# EasyEDA Pro project ProPrj_ESP系列自动烧录平台_2024-12-23.epro, board ESP全系列烧录平台 copy
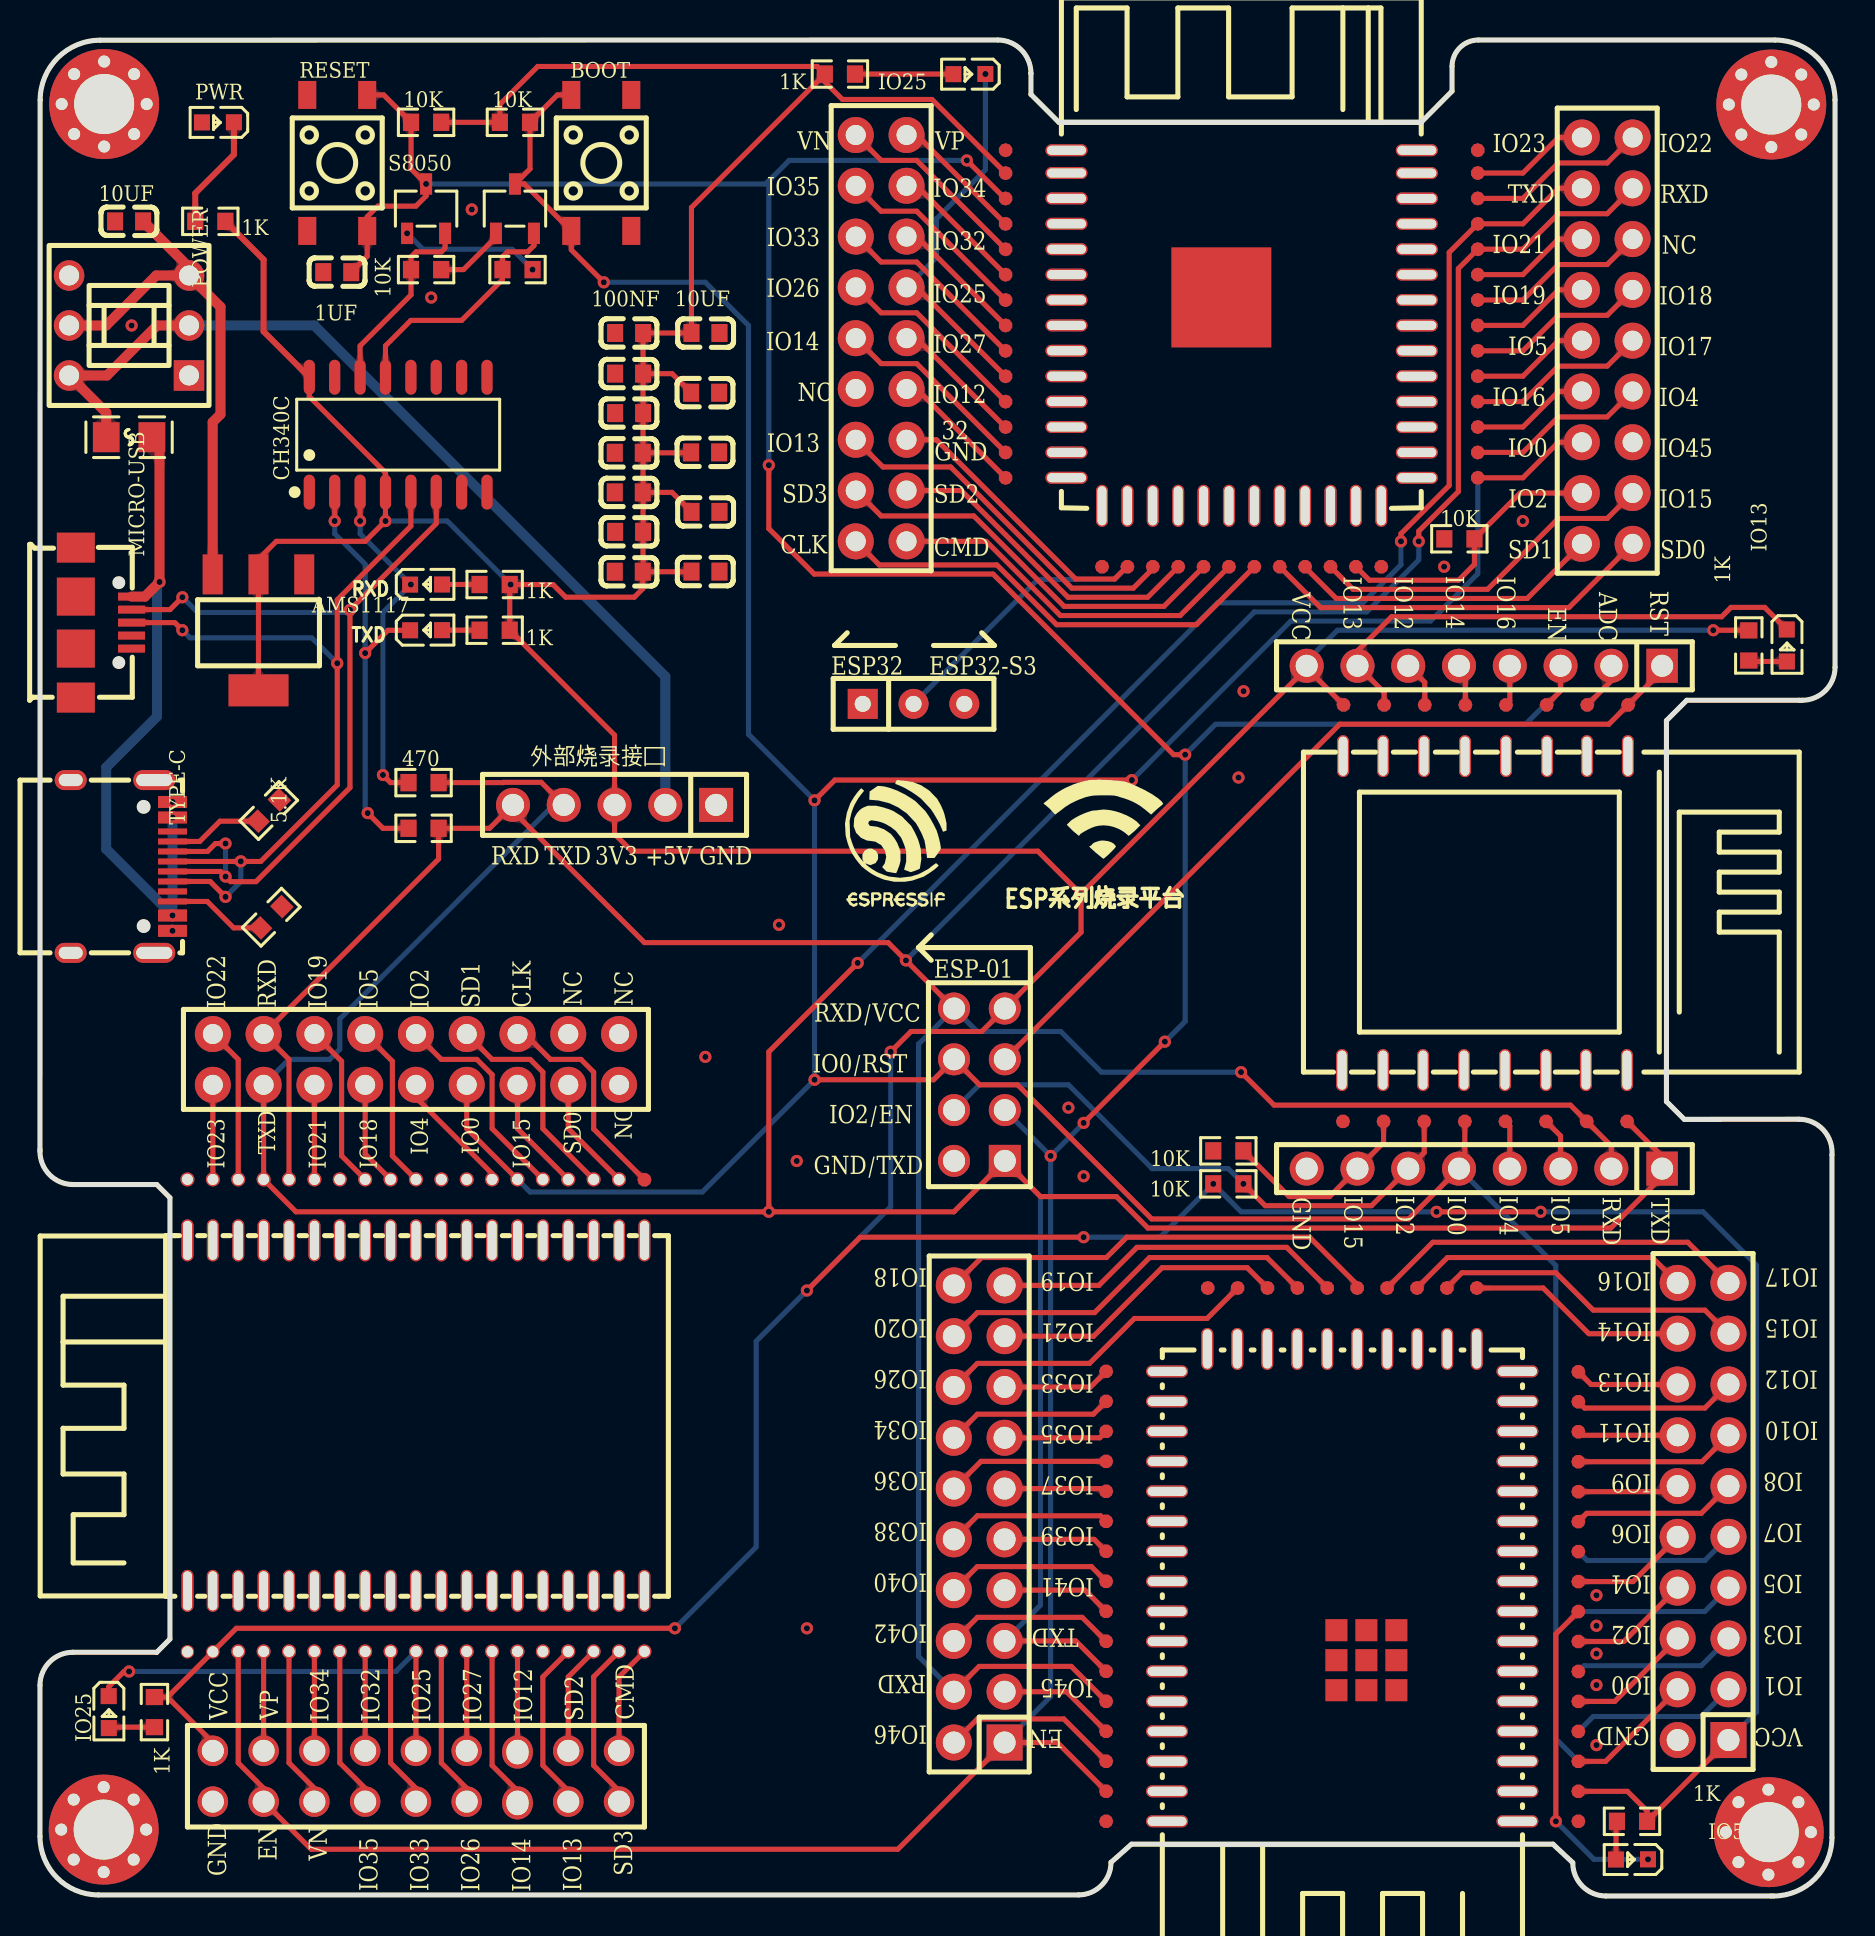
[diagram p1: board, top side]
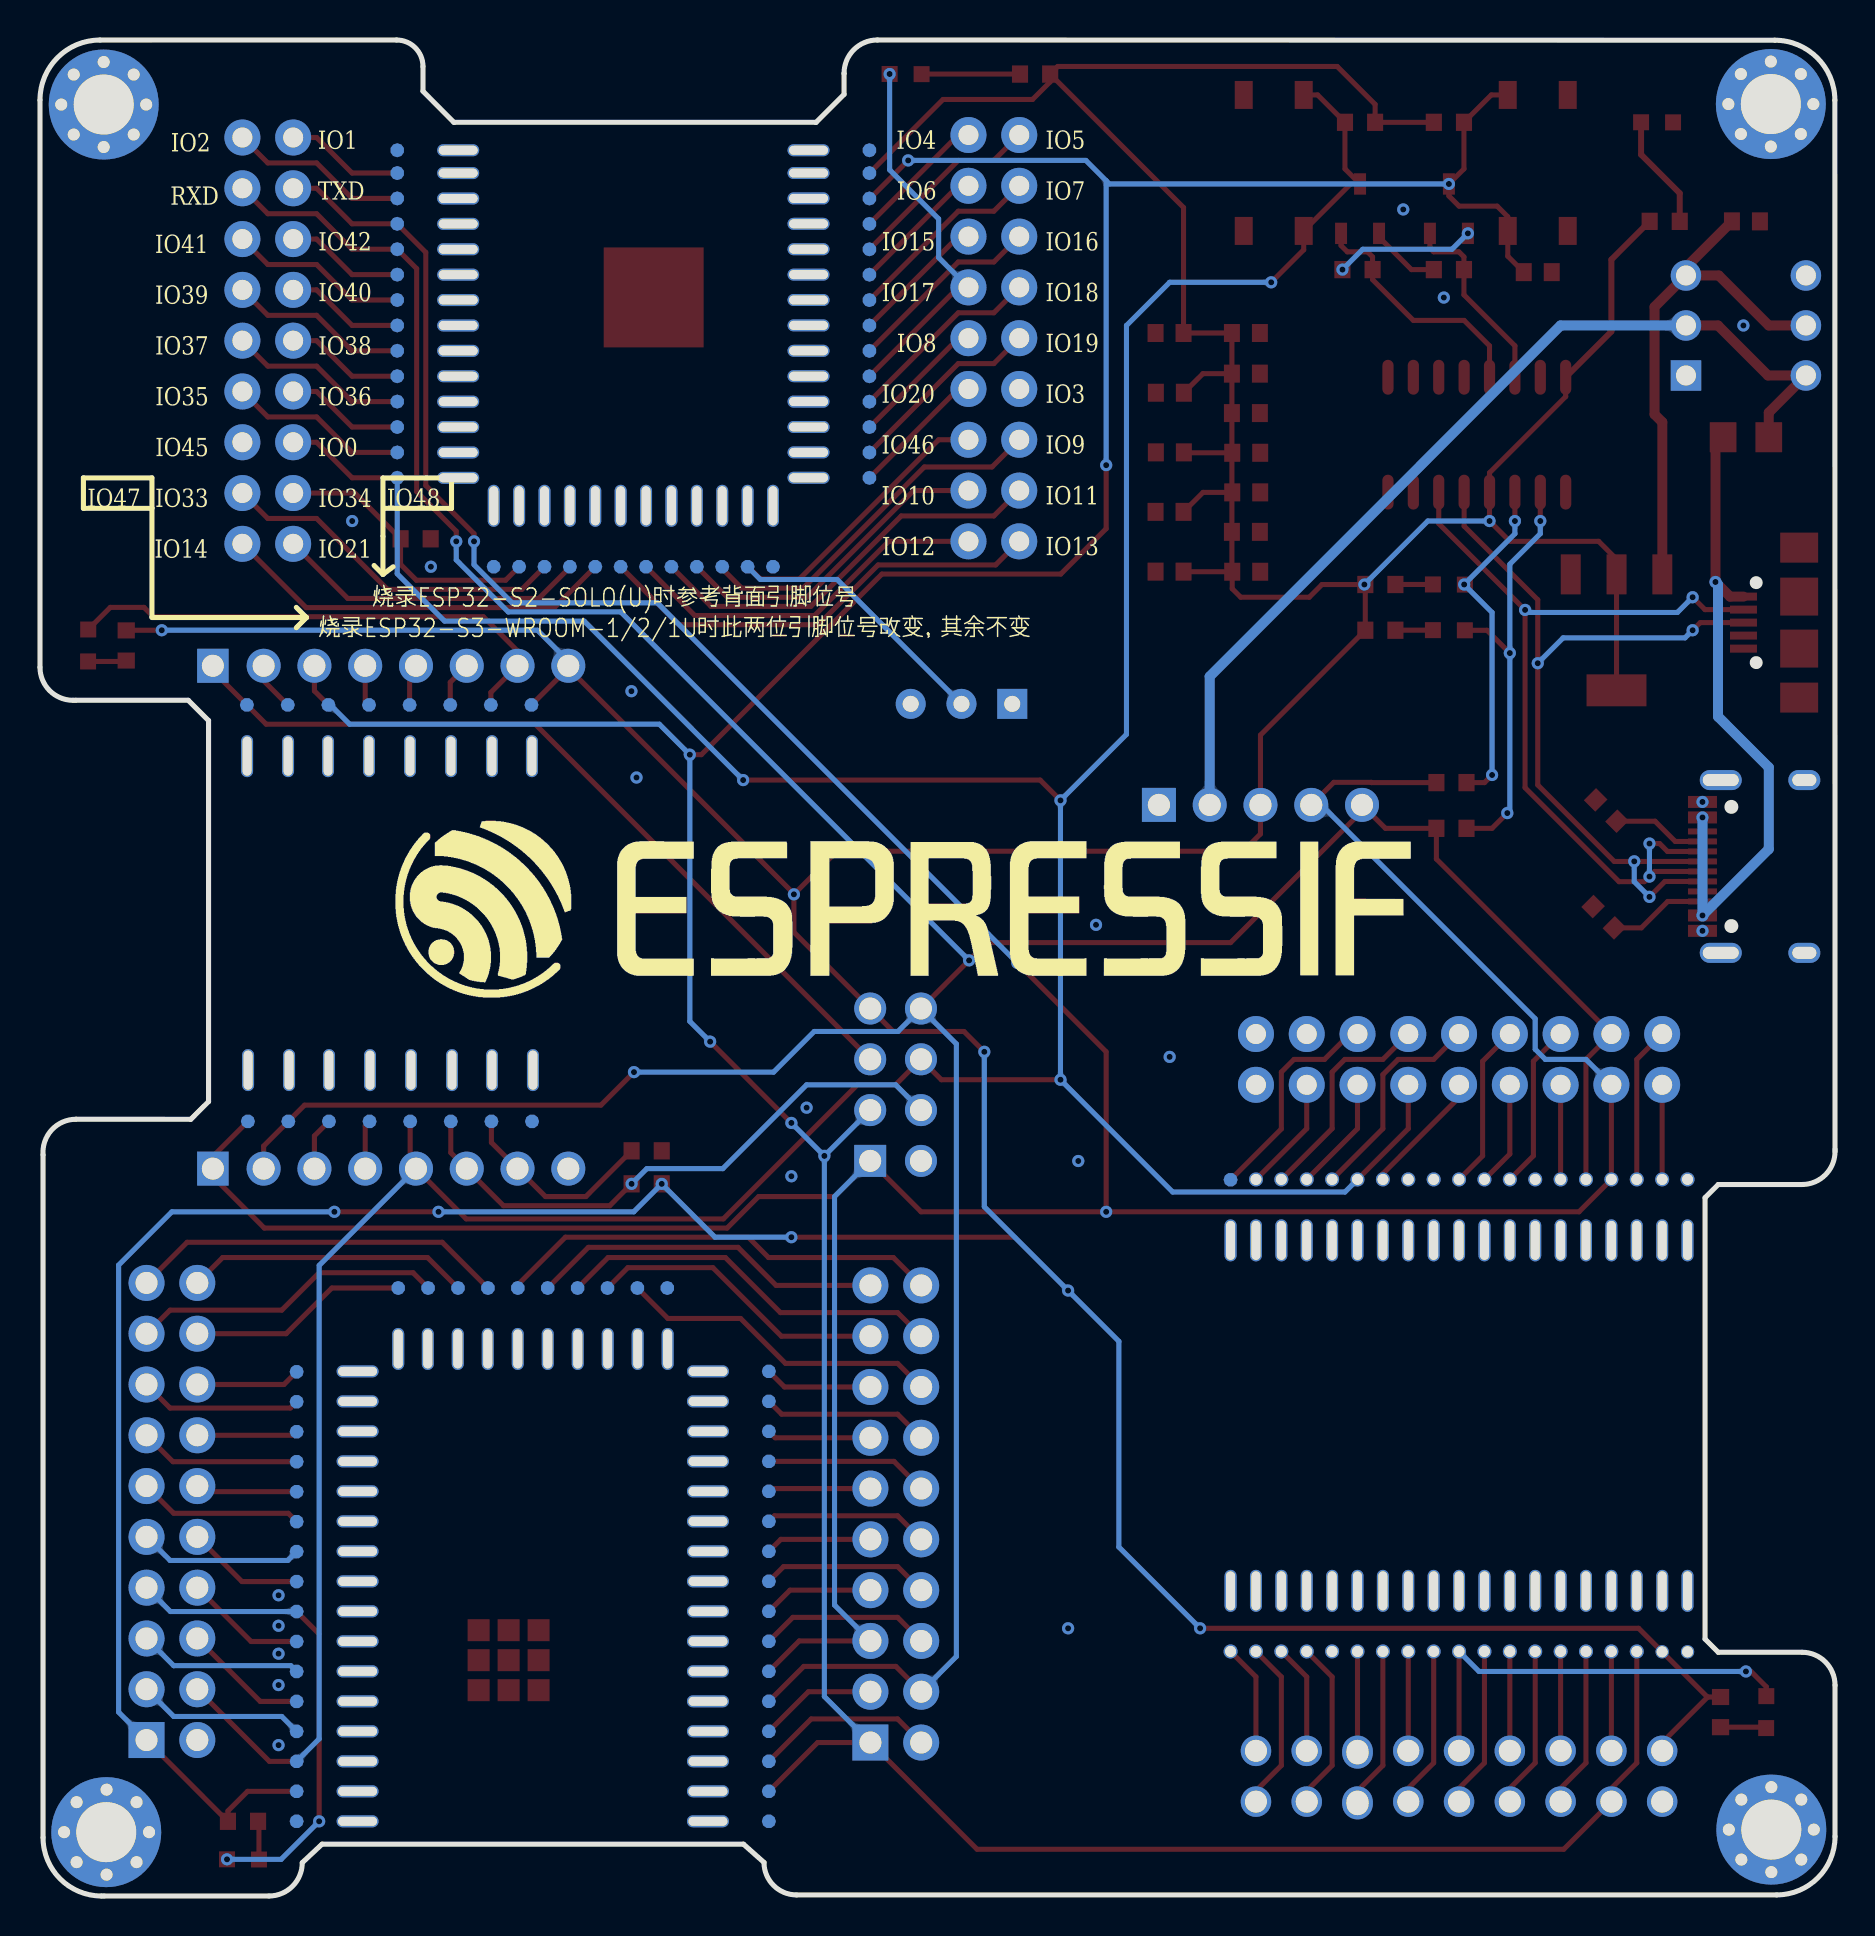
[diagram p2: board, bottom side, seen from below]

Outline 89.8 x 92.82 mm; copper layers: Top Layer, Bottom Layer. Coordinates in mm from the lower left corner of the outline.
Outline path: 0,37.23 0,37.34 0.01,89.81 arc(0.89,91.93) 3.02,92.8 47.91,92.82 arc(49.09,92.33) 49.57,91.15 49.57,90.1 50.97,88.7 69.09,88.7 70.64,90.26 70.64,91.49 arc(71.03,92.43) 71.96,92.82 86.8,92.81 arc(88.92,91.93) 89.8,89.81 89.8,61.45 arc(89.31,60.28) 88.15,59.8 82.38,59.8 81.36,58.78 81.36,39.73 82.25,38.84 87.99,38.85 arc(89.21,38.31) 89.64,37.06 89.64,2.92 arc(88.79,0.86) 86.72,0 78.34,0 arc(77.16,0.49) 76.68,1.67 75.69,2.59 54.6,2.59 53.58,1.68 arc(53.1,0.53) 51.95,0.05 2.92,0.05 arc(0.86,0.91) 0,2.98 0,10.54 arc(0.48,11.71) 1.65,12.19 5.84,12.19 6.5,12.85 6.5,34.92 5.84,35.58 1.65,35.58 arc(0.48,36.06) 0,37.23
Stack: Top Layer 0.035mm / Dielectric1 1.51mm FR4 er 4.5 / Bottom Layer 0.035mm

## Design rules (mm)
template: 自定义配置
spacing copperThickness1oz: track to track 0.102, other pairs 0.152 to 0.3
spacing copperThickness2oz (default): track to track 0.203, other pairs 0.152 to 0.3
spacing copperThicknessInner0.5oz: track to track 0.089, other pairs 0.152 to 0.3
track width copperThickness1oz (default): min 0.102, default 0.254, max 2.54
track width copperThickness2oz: min 0.203, default 0.254, max 2.54
track width copperThickness0.5oz: min 0.089, default 0.254, max 2.54
differential pair differentialPair (default): width min 0.127, default 0.254, max 2.54; gap min 0.152, default 0.152
via viaSize (default): diameter min 0.3, default 0.61, max 10; hole min 0.2, default 0.305, max 6.3

## Placement (name value [footprint] x y rotation side)
1K  -  [R0603]  85.48 62.54 270 top
1K#2  -  [R0603]  40.02 91.11 0 top
1K#3  -  [R0603]  5.73 9.2 270 top
1K#4  -  [R0603]  79.64 3.74 180 top
1K#5  -  [R0603]  8.52 83.75 180 top
1K#6  -  [R0603]  22.74 63.3 180 top
1K#7  -  [R0603]  22.74 65.58 180 top
1UF  1uF  [C0603]  14.87 81.21 0 top
5.1K  -  [R0603]  11.44 54.28 45 top
5.1K#2  -  [R0603]  11.57 48.95 45 top
10K  -  [R0603]  71 67.87 180 top
10K#2  -  [R0603]  23.76 88.7 180 top
10K#3  -  [R0603]  59.45 35.61 180 top
10K#4  -  [R0603]  19.32 88.7 0 top
10K#5  -  [R0603]  59.45 37.26 180 top
10K#6  -  [R0603]  19.32 81.33 0 top
10UF  -  [C0603]  33.29 66.23 0 top
10UF#2  -  [C0603]  33.27 75.18 0 top
10UF#3  -  [C0603]  33.27 72.19 0 top
10UF#4  -  [C0603]  33.29 69.22 180 top
10UF#5  -  [C0603]  33.29 78.16 180 top
10UF#6  -  [C0603]  4.46 83.75 0 top
100NF  -  [C0603]  29.46 70.19 180 top
100NF#2  -  [C0603]  29.46 72.17 180 top
100NF#3  -  [C0603]  29.46 66.22 180 top
100NF#4  -  [C0603]  29.47 68.22 0 top
100NF#5  -  [C0603]  29.47 76.13 0 top
100NF#6  -  [C0603]  29.47 74.16 0 top
100NF#7  -  [C0603]  29.47 78.16 0 top
470  470  [R0603]  19.19 55.68 180 top
AMS1117  AMS1117-3.3_C917183  [AMS1117-3.3]  13.22 66.09 180 top
BOOT  TS-1009S-04526  [SW-SMD_4P-L4.5-W4.5-P3.00-LS7.0]  28.08 86.67 90 top
CH340C  CH340C  [SOP-16_L10.0-W3.9-P1.27-LS6.0-BL]  17.92 73.08 0 top
ESP32-WROVER-B/IB/E/IE烧录架1  -  [ESP32-WROVER-B/IB/E/IE烧录架 3.0]  17.79 24.15 90 top
H1  220S-2*10P H=8.5MM Ytype Gold-plated  [HDR-TH_20P-P2.54-V-F-R2-C10-S2.54]  83.2 19.23 90 top
H2  220S-2*10P H=8.5MM Ytype Gold-plated  [HDR-TH_20P-P2.54-V-F-R2-C10-S2.54]  46.98 19.11 90 top
H3  -  [2.54-2*9P母]  18.81 5.99 0 top
H4  -  [2.54-2*9P母#2]  18.81 41.84 0 top
H5  -  [PH-00759]  28.74 54.56 180 top
H6  -  [2.54-2*9P母#2]  42.08 77.9 270 top
H7  -  [2.54-2*9P母#2]  78.4 77.78 270 top
H8  -  [KH-2.54PH180-1X8P-L11.5]  72.26 61.65 180 top
H9  -  [KH-2.54PH180-1X8P-L11.5]  72.26 36.5 180 top
IO5  KT-0603R  [LED0603-RD]  79.64 1.83 180 top
IO13  KT-0603R  [LED0603-RD]  87.39 62.54 270 top
IO25  -  [LED0603-RD]  46.49 91.11 180 top
IO25#2  -  [LED0603-RD]  3.44 9.2 270 top
MICRO-USB  MK5P卧贴带柱  [MICRO-USB-SMD_5P-P0.65-H-M_MICRO-USB-5P]  3.19 63.68 270 top
NOREF  -  [Pad_e2439]  3.19 3.32 0 top
NOREF#2  -  [Pad_e2451]  88.59 3.19 0 top
NOREF#3  -  [Pad_e2428]  1.71 88.11 0 top
NOREF#4  -  [Pad_e2421]  3.21 89.61 0 top
NOREF#5  -  [Pad_e2434]  88.11 88.09 0 top
NOREF#6  -  [Pad_e2449]  86.46 5.32 0 top
NOREF#7  -  [Pad_e2425]  4.71 88.11 0 top
NOREF#8  -  [Pad_e2455]  84.96 1.69 0 top
NOREF#9  -  [Pad_e2424]  5.34 89.61 0 top
NOREF#10  -  [Pad_e2456]  86.46 1.07 0 top
NOREF#11  -  [Pad_e2430]  86.61 89.59 0 top
NOREF#12  -  [Pad_e2444]  1.69 4.82 0 top
NOREF#13  -  [Pad_e2432]  88.11 91.09 0 top
NOREF#14  -  [Pad_e2446]  1.69 1.82 0 top
NOREF#15  -  [Pad_e2441]  4.69 4.82 0 top
NOREF#16  -  [Pad_e2442]  5.31 3.32 0 top
NOREF#17  -  [Pad_e2448]  86.48 3.19 0 top
NOREF#18  -  [Pad_e2396]  23.89 4.59 0 top
NOREF#19  -  [Pad_e2438]  86.61 87.46 0 top
NOREF#20  -  [Pad_e2422]  3.21 91.74 0 top
NOREF#21  -  [Pad_e2450]  87.96 4.69 0 top
NOREF#22  -  [Pad_e2433]  88.73 89.59 0 top
NOREF#23  -  [Pad_e2453]  84.96 4.69 0 top
NOREF#24  -  [Pad_e2426]  1.71 91.11 0 top
NOREF#25  -  [Pad_e2437]  85.11 88.09 0 top
NOREF#26  -  [Pad_e2440]  3.19 5.45 0 top
NOREF#27  -  [Pad_e2452]  87.96 1.69 0 top
NOREF#28  -  [Pad_e2431]  86.61 91.71 0 top
NOREF#29  -  [Pad_e2454]  84.34 3.19 0 top
NOREF#30  -  [Pad_e2423]  4.71 91.11 0 top
NOREF#31  -  [Pad_e2429]  3.21 87.49 0 top
NOREF#32  -  [Pad_e2427]  1.09 89.61 0 top
NOREF#33  -  [Pad_e2443]  4.69 1.82 0 top
NOREF#34  -  [Pad_e2436]  84.48 89.59 0 top
NOREF#35  -  [Pad_e2447]  3.19 1.2 0 top
NOREF#36  -  [Pad_e2445]  1.06 3.32 0 top
NOREF#37  -  [Pad_e2397]  23.89 7.13 0 top
NOREF#38  -  [Pad_e2435]  85.11 91.09 0 top
POWER  XKB8080-Z  [SW-TH_6P-L8.0-W8.0-P2.50]  4.46 78.54 90 top
PWR  KT-0603R  [LED0603-RD]  8.9 88.7 180 top
Q1  -  [S8050]  23.76 84.38 0 top
R9  10K  [R0603]  23.89 81.33 0 top
R13  470Ω  [R0603]  19.19 53.39 180 top
RESET  TS-1009S-04526  [SW-SMD_4P-L4.5-W4.5-P3.00-LS7.0]  14.87 86.67 270 top
RXD  KT-0603R  [LED0603-RD]  19.32 65.58 0 top
S8050  -  [S8050]  19.32 84.38 0 top
TXD  KT-0603R  [LED0603-RD]  19.32 63.3 0 top
TYPE-C  -  [TYPEC-304-BCP16]  3.19 51.11 90 top
U4  -  [ESP12F烧录]  63.24 50.73 270 top
U5  -  [ESP-01S]  47 40.44 90 top
U6  AMS1117-3.3  [HDR-TH_3P-P2.54-V-M-3]  43.7 59.62 0 top
U7  SMD0805B050TF  [F0805]  4.46 72.95 180 top
U8  CH340C  [ESP32-S2-WROVER(I)-ESP32-S2-WROOM(I) 3.0]  66.29 10.34 180 top
U9  -  [ESP32-S2/3-WROOM-1/2 3.0]  59.73 81.21 0 top

## Footprints (pads in the part's own frame, mm; a bottom-side part is the same pattern mirrored in y, then rotated)
2.54-2*9P母
  round 1.524 hole 1.1: 1(-10.16,-1.27) 2(-10.16,1.27) 3(-7.62,-1.27) 4(-7.62,1.27) 5(-5.08,-1.27) 6(-5.08,1.27) 7(-2.54,-1.27) 8(-2.54,1.27) 9(0,-1.27) 10(0,1.27) 11(2.54,-1.27) 12(2.54,1.27) 13(5.08,-1.27) 14(5.08,1.27) 15(7.62,-1.27) 16(7.62,1.27) 17(10.16,-1.27) 18(10.16,1.27)
2.54-2*9P母#2
  round 1.8 hole 1: 1(-10.16,-1.27) 2(-10.16,1.27) 3(-7.62,-1.27) 4(-7.62,1.27) 5(-5.08,-1.27) 6(-5.08,1.27) 7(-2.54,-1.27) 8(-2.54,1.27) 9(0,-1.27) 10(0,1.27) 11(2.54,-1.27) 12(2.54,1.27) 13(5.08,-1.27) 14(5.08,1.27) 15(7.62,-1.27) 16(7.62,1.27) 17(10.16,-1.27) 18(10.16,1.27)
AMS1117-3.3
  custom 1x2 smd: 1(0,0) 2(2.29,0) 3(4.58,0)
  rect 3x1.6 smd: 4(2.29,5.8)
C0603
  rect 0.8x0.9 smd: 1(-0.7,0) 2(0.7,0)
ESP12F烧录
  custom 0.665x0.7 hole 0.55: 3V3(-8.839,1.969) ADC(-8.839,14.161) EN(-8.839,12.129) GND(11.989,1.941) IO0(11.989,8.037) IO2(11.989,6.005) IO4(11.989,10.069) IO5(11.989,12.101) IO12(-8.839,6.033) IO13(-8.839,4.001) IO14(-8.839,8.065) IO15(11.989,3.973) IO16(-8.839,10.097) RST(-8.839,16.205) RXD(11.989,14.133) TXD(11.989,16.154)
  oval 2.1x0.6 hole 1.95x0.45: 23(9.424,1.896) 24(9.424,3.946) 25(9.424,5.946) 26(9.424,7.996) 27(9.425,10.046) 28(9.423,12.096) 29(9.423,14.096) 30(9.424,16.146) 31(-6.277,1.946) 32(-6.276,3.946) 33(-6.276,5.996) 34(-6.276,8.046) 35(-6.279,10.097) 36(-6.276,12.146) 37(-6.277,14.146) 38(-6.277,16.196)
ESP32-S2-WROVER(I)-ESP32-S2-WROOM(I) 3.0
  custom 0.7x0.665 hole 0.55: 3V3(-10.668,5.105) EN(12.954,5.104) IO0(-10.668,3.607) S2_IO1(-10.668,2.108) S2_IO4(-10.668,-2.388) S2_IO5(-10.668,-3.886) S2_IO6(-10.668,-5.385) S2_IO9(-10.668,-9.88) S2_IO10(-10.668,-11.379) S2_IO33(12.954,-15.896) S2_IO34(12.954,-14.396) S2_IO35(12.954,-12.896) S2_IO37(12.954,-9.896) S2_IO39(12.954,-6.896) S2_IO40(12.954,-3.896) S2_IO45(12.954,2.104) TXD(12.954,-0.896)
  custom 0.7x0.666 hole 0.55: 15(-10.668,-14.377) 94(12.954,-5.396) 95(12.954,6.604) GND(-10.668,6.604) RXD(12.954,0.604) S2_IO2(-10.668,0.61) S2_IO3(-10.668,-0.889) S2_IO7(-10.668,-6.883) S2_IO8(-10.668,-8.382) S2_IO11(-10.668,-12.878) S2_IO13(-10.668,-15.875) S2_IO36(12.954,-11.396) S2_IO38(12.954,-8.396) S2_IO41(12.954,-2.396) S2_IO46(12.954,3.604)
  rect 1.1x1.1 smd: 43(-0.064,-1.453) 86(-1.564,-1.453) 87(1.436,-1.453) 88(1.436,0.047) 89(-0.064,0.047) 90(-1.564,0.047) 91(-1.564,-2.953) 92(-0.064,-2.953) 93(1.436,-2.953)
  oval 2.1x0.6 hole 1.95x0.45: 44(-7.62,6.604) 45(-7.62,5.104) 46(-7.62,3.604) 47(-7.62,2.104) 48(-7.62,0.604) 49(-7.62,-0.896) 50(-7.62,-2.396) 51(-7.62,-3.896) 52(-7.62,-5.396) 53(-7.62,-6.896) 54(-7.62,-8.396) 55(-7.62,-9.896) 56(-7.62,-11.396) 58(-7.62,-14.396) 59(-7.62,-15.896) 70(9.906,-15.896) 71(9.906,-14.396) 72(9.906,-12.896) 73(9.906,-11.396) 74(9.906,-9.896) 75(9.906,-8.396) 76(9.906,-6.896) 77(9.906,-5.396) 78(9.906,-3.896) 79(9.906,-2.396) 80(9.906,-0.896) 81(9.906,0.604) 82(9.906,2.104) 83(9.906,3.604) 84(9.906,5.104) 85(9.906,6.604) S2_IO12(-7.62,-12.896)
  oval 0.6x2.1 hole 0.45x1.95: 60(-5.588,-17.018) 61(-4.107,-17.018) 62(-2.607,-17.018) 63(-1.107,-17.018) 64(0.393,-17.018) 65(1.893,-17.018) 66(3.393,-17.018) 67(4.893,-17.018) 68(6.393,-17.018) 69(7.893,-17.018)
  custom 0.666x0.7 hole 0.55x0.555: 96(7.874,-20.066) S2_IO14(-5.588,-20.066) S2_IO16(-2.596,-20.066) S2_IO18(0.395,-20.066) S2_IO21(4.883,-20.066)
  custom 0.665x0.7 hole 0.55x0.555: S2_IO15(-4.092,-20.066) S2_IO17(-1.101,-20.066) S2_IO19(1.891,-20.066) S2_IO20(3.386,-20.066) S2_IO26(6.378,-20.066)
ESP32-S2/3-WROOM-1/2 3.0
  custom 0.665x0.7 hole 0.55: 3V3(-11.43,4.953) 82(12.192,6.096) 83(-11.43,6.096) EN(-11.43,3.683) ESP32_IO4(12.192,-9.018) ESP32_IO05(12.192,-5.204) ESP32_IO12(-11.43,-10.287) ESP32_IO14(-11.43,-9.017) ESP32_IO16(12.192,-7.744) ESP32_IO17(12.192,-6.473) ESP32_IO18(12.192,-3.933) ESP32_IO19(12.192,-2.663) ESP32_IO21(12.192,-0.123) ESP32_IO22(12.192,3.687) ESP32_IO23(12.192,4.957) ESP32_IO25(-11.43,-5.207) ESP32_IO26(-11.43,-6.476) ESP32_IO27(-11.43,-7.747) ESP32_IO32(-11.43,-2.667) ESP32_IO33(-11.43,-3.937) ESP32_IO34(-11.43,-0.127) ESP32_IO35(-11.43,-1.397) ESP32_NC(12.192,-1.393) ESP32_VN(-11.43,1.143) ESP32_VP(-11.43,2.413) IO0(12.192,-10.284) RXD(12.192,1.147) TXD(12.192,2.417)
  oval 0.6x2.1 hole 0.45x1.95: 40(6.095,-11.684) 41(4.825,-11.684) 42(3.555,-11.684) 43(2.285,-11.684) 44(1.015,-11.684) 45(-1.525,-11.684) 46(-0.255,-11.684) 47(-2.795,-11.684) 48(-4.065,-11.684) 49(-5.335,-11.684) 79(-6.604,-11.684) 81(7.365,-11.684)
  oval 2.1x0.6 hole 1.95x0.45: 50(9.144,6.096) 51(9.144,4.954) 52(9.144,3.684) 53(9.144,2.414) 54(9.144,1.144) 55(9.144,-0.126) 56(9.144,-1.396) 57(9.144,-2.666) 58(9.144,-3.936) 59(9.144,-6.476) 60(9.144,-5.206) 61(9.144,-7.746) 62(9.144,-9.016) 63(9.144,-10.286) 64(-8.382,-10.283) 65(-8.382,-9.013) 66(-8.382,-7.743) 67(-8.382,-6.473) 68(-8.382,-5.203) 69(-8.382,-3.933) 70(-8.382,-2.663) 71(-8.382,-1.393) 72(-8.382,-0.123) 73(-8.382,1.147) 74(-8.382,2.417) 75(-8.382,3.687) 76(-8.382,4.957) 77(-8.382,6.096)
  custom 0.7x0.666 hole 0.55: 78(-6.604,-14.732) 80(7.366,-14.732) ESP32_CLK(1.016,-14.732) ESP32_CMD(-0.254,-14.732) ESP32_GND(-5.334,-14.732) ESP32_IO02(6.096,-14.732) ESP32_IO13(-4.064,-14.732) ESP32_IO15(4.826,-14.732) ESP32_SD0(2.286,-14.732) ESP32_SD1(3.556,-14.732) ESP32_SD2(-2.794,-14.732) ESP32_SD3(-1.524,-14.732)
  rect 5x5 smd: GND(-0.636,-1.264)
ESP32-WROVER-B/IB/E/IE烧录架 3.0
  round 0.665 hole 0.55: 3V3(-11.938,9.144) 78(-11.938,10.414)
  round 0.7 hole 0.55: 27(11.684,-3.556) 28(11.684,-2.286) 32(11.684,2.794) 32W_CMD(-11.921,-12.446) 32W_IO2(11.684,-7.366) 32W_IO4(11.684,-4.826) 32W_IO5(11.684,-1.016) 32W_IO12(-11.921,-6.096) 32W_IO13(-11.921,-8.636) 32W_IO14(-11.921,-4.826) 32W_IO15(11.684,-8.636) 32W_IO18(11.684,0.254) 32W_IO19(11.684,1.524) 32W_IO21(11.684,4.064) 32W_IO22(11.684,7.874) 32W_IO23(11.684,9.144) 32W_IO25(-11.921,-1.016) 32W_IO26(-11.921,-2.286) 32W_IO27(-11.921,-3.556) 32W_IO32(-11.921,1.524) 32W_IO33(-11.921,0.254) 32W_IO34(-11.921,4.064) 32W_IO35(-11.921,2.794) 32W_SD0(11.684,-11.176) 32W_SD1(11.684,-9.906) 32W_SD2(-11.921,-9.906) 32W_SD3(-11.921,-11.176) 32W_VN(-11.921,5.334) 32W_VP(-11.921,6.604) 77(-11.921,-7.366) EN(-11.921,7.874) GND(11.684,10.414) IO0(11.684,-6.096) RXD(11.684,5.334) TXD(11.684,6.604)
  custom 0.665x0.7 hole 0.55: 32W_CLK(11.667,-12.446)
  oval 2.1x0.6 hole 1.95x0.45: 39(8.636,10.414) 40(8.636,9.144) 41(8.636,7.874) 42(8.636,6.604) 43(8.636,5.334) 44(8.636,4.064) 45(8.636,2.794) 46(8.636,1.524) 47(8.636,0.254) 48(8.636,-1.016) 49(8.636,-2.286) 50(8.636,-3.556) 51(8.636,-4.826) 52(8.636,-6.096) 53(8.636,-7.366) 54(8.636,-8.636) 55(8.636,-9.906) 56(8.636,-11.176) 57(8.636,-12.446) 58(-8.89,-12.446) 59(-8.89,-11.176) 60(-8.89,-9.906) 61(-8.89,-8.636) 62(-8.89,-7.366) 63(-8.89,-6.096) 64(-8.89,-4.826) 65(-8.89,-3.556) 66(-8.89,-2.286) 67(-8.89,-1.016) 68(-8.89,0.254) 69(-8.89,1.524) 70(-8.89,2.794) 71(-8.89,4.064) 72(-8.89,5.334) 73(-8.89,6.604) 74(-8.89,7.874) 75(-8.89,9.147) 76(-8.89,10.414)
ESP-01S
  rect 1.6x1.6 hole 1.1: 1(-3.683,-1.27)
  round 1.6 hole 1.1: 2(-3.683,1.27) 3(-1.143,-1.27) 4(-1.143,1.27) 5(1.397,-1.27) 6(1.397,1.27) 7(3.937,-1.27) 8(3.937,1.27)
F0805
  rect 1.335x1.5 smd: 1(-1.143,0) 2(1.143,0)
HDR-TH_3P-P2.54-V-M-3
  rect 1.5x1.5 hole 0.8: 1(-2.54,0)
  round 1.5 hole 0.8: 2(0,0) 3(2.54,0)
HDR-TH_20P-P2.54-V-F-R2-C10-S2.54
  rect 1.8x1.8 hole 1.1: 1(-11.43,-1.27)
  round 1.8 hole 1.1: 2(-11.43,1.27) 3(-8.89,-1.27) 4(-8.89,1.27) 5(-6.35,-1.27) 6(-6.35,1.27) 7(-3.81,-1.27) 8(-3.81,1.27) 9(-1.27,-1.27) 10(-1.27,1.27) 11(1.27,-1.27) 12(1.27,1.27) 13(3.81,-1.27) 14(3.81,1.27) 15(6.35,-1.27) 16(6.35,1.27) 17(8.89,-1.27) 18(8.89,1.27) 19(11.43,-1.27) 20(11.43,1.27)
KH-2.54PH180-1X8P-L11.5
  rect 1.575x1.7 hole 1.1: 1(-8.89,0.127)
  round 1.7 hole 1.1: 2(-6.35,0.127) 3(-3.81,0.127) 4(-1.27,0.127) 5(1.27,0.127) 6(3.81,0.127) 7(6.35,0.127) 8(8.89,0.127)
LED0603-RD
  rect 0.8x0.8 smd: 1(-0.799,-0.004) 2(0.799,0.004)
MICRO-USB-SMD_5P-P0.65-H-M_MICRO-USB-5P
  rect 1.5x1.9 smd: 0(-3.749,-1.393) 0(3.749,-1.393)
  rect 1.9x1.9 smd: 0(-1.3,-1.393) 0(1.3,-1.393)
  rect 0.4x1.35 smd: 1(-1.3,1.393) 2(-0.65,1.393) 3(0,1.393) 4(0.65,1.393) 5(1.3,1.393)
Pad_e2396
  round 1.524 hole 1.1: 5(0,0)
Pad_e2397
  round 1.524 hole 1.1: 6(0,0)
Pad_e2421
  round 5.5 hole 3: 1(0,0)
Pad_e2422
  round 0.61 hole 0.6: 1(0,0)
Pad_e2423
  round 0.61 hole 0.6: 1(0,0)
Pad_e2424
  round 0.61 hole 0.6: 1(0,0)
Pad_e2425
  round 0.61 hole 0.6: 1(0,0)
Pad_e2426
  round 0.61 hole 0.6: 1(0,0)
Pad_e2427
  round 0.61 hole 0.6: 1(0,0)
Pad_e2428
  round 0.61 hole 0.6: 1(0,0)
Pad_e2429
  round 0.61 hole 0.6: 1(0,0)
Pad_e2430
  round 5.5 hole 3: 1(0,0)
Pad_e2431
  round 0.61 hole 0.6: 1(0,0)
Pad_e2432
  round 0.61 hole 0.6: 1(0,0)
Pad_e2433
  round 0.61 hole 0.6: 1(0,0)
Pad_e2434
  round 0.61 hole 0.6: 1(0,0)
Pad_e2435
  round 0.61 hole 0.6: 1(0,0)
Pad_e2436
  round 0.61 hole 0.6: 1(0,0)
Pad_e2437
  round 0.61 hole 0.6: 1(0,0)
Pad_e2438
  round 0.61 hole 0.6: 1(0,0)
Pad_e2439
  round 5.5 hole 3: 1(0,0)
Pad_e2440
  round 0.61 hole 0.6: 1(0,0)
Pad_e2441
  round 0.61 hole 0.6: 1(0,0)
Pad_e2442
  round 0.61 hole 0.6: 1(0,0)
Pad_e2443
  round 0.61 hole 0.6: 1(0,0)
Pad_e2444
  round 0.61 hole 0.6: 1(0,0)
Pad_e2445
  round 0.61 hole 0.6: 1(0,0)
Pad_e2446
  round 0.61 hole 0.6: 1(0,0)
Pad_e2447
  round 0.61 hole 0.6: 1(0,0)
Pad_e2448
  round 5.5 hole 3: 1(0,0)
Pad_e2449
  round 0.61 hole 0.6: 1(0,0)
Pad_e2450
  round 0.61 hole 0.6: 1(0,0)
Pad_e2451
  round 0.61 hole 0.6: 1(0,0)
Pad_e2452
  round 0.61 hole 0.6: 1(0,0)
Pad_e2453
  round 0.61 hole 0.6: 1(0,0)
Pad_e2454
  round 0.61 hole 0.6: 1(0,0)
Pad_e2455
  round 0.61 hole 0.6: 1(0,0)
Pad_e2456
  round 0.61 hole 0.6: 1(0,0)
PH-00759
  rect 1.7x1.7 hole 1.105x1.1: 1(-5.08,0)
  round 1.7 hole 1.105x1.1: 2(-2.54,0) 3(0,0) 4(2.54,0) 5(5.08,0)
R0603
  rect 0.806x0.864 smd: 1(-0.753,0) 2(0.753,0)
S8050
  rect 0.6x1.07 smd: 1(-0.95,-1.235) 2(0.95,-1.235) 3(0,1.235)
SOP-16_L10.0-W3.9-P1.27-LS6.0-BL
  oval 0.56x1.745 smd: 1(-4.445,-2.873) 2(-3.175,-2.873) 3(-1.905,-2.873) 4(-0.635,-2.873) 5(0.635,-2.873) 6(1.905,-2.873) 7(3.175,-2.873) 8(4.445,-2.873) 9(4.445,2.873) 10(3.175,2.873) 11(1.905,2.873) 12(0.635,2.873) 13(-0.635,2.873) 14(-1.905,2.873) 15(-3.175,2.873) 16(-4.445,2.873)
SW-SMD_4P-L4.5-W4.5-P3.00-LS7.0
  rect 1.4x0.9 smd: 1(-3.4,1.5) 2(3.4,1.5) 3(-3.4,-1.5) 4(3.4,-1.5)
SW-TH_6P-L8.0-W8.0-P2.50
  rect 1.524x1.524 hole 1: 1(-2.5,-3)
  round 1.524 hole 1: 2(0,-3) 3(2.5,-3) 4(-2.5,3) 5(0,3) 6(2.5,3)
TYPEC-304-BCP16
  oval 1x2.1 hole 0.6x1.8: 13(4.699,-2.529) 14(-3.941,-2.529)
  oval 1x1.6 hole 0.6x1.2: 15(4.699,1.651) 16(-3.941,1.651)
  rect 0.6x1.45 smd: A1B12(3.604,-3.444) A4B9(2.829,-3.444) B1A12(-2.841,-3.444) B4A9(-2.071,-3.444)
  rect 0.3x1.45 smd: A5(1.629,-3.443) A6(0.629,-3.444) A7(0.13,-3.444) A8(-0.871,-3.444) B5(-1.371,-3.444) B6(-0.371,-3.444) B7(1.129,-3.444) B8(2.13,-3.444)

## Nets
3V3: 1K.1 1K#2.1 1K#3.1 1K#4.1 1K#5.1 1K#6.1 1K#7.1 10K#2.2 10K#3.2 10K#4.2 10UF.1 10UF#2.1 10UF#3.1 10UF#4.2 10UF#5.2 100NF.1 100NF#2.1 100NF#3.1 100NF#4.2 100NF#5.2 100NF#6.2 100NF#7.2 AMS1117.2 AMS1117.4 CH340C.4 CH340C.16 ESP32-WROVER-B/IB/E/IE烧录架1.3V3 H1.1 H3.2 H5.3 H8.8 U4.3V3 U5.7 U8.3V3 U9.3V3
+5V: H5.2 POWER.2 POWER.4 U7.2
GND: 1UF.1 5.1K.2 5.1K#2.2 10K.2 10K#5.2 10UF.2 10UF#2.2 10UF#3.2 10UF#4.1 10UF#5.1 10UF#6.1 100NF.2 100NF#2.2 100NF#3.2 100NF#4.1 100NF#5.1 100NF#6.1 100NF#7.1 AMS1117.1 BOOT.3 BOOT.4 CH340C.1 ESP32-WROVER-B/IB/E/IE烧录架1.77 ESP32-WROVER-B/IB/E/IE烧录架1.78 ESP32-WROVER-B/IB/E/IE烧录架1.GND H1.2 H3.1 H5.1 H9.8 MICRO-USB.0 MICRO-USB.5 PWR.2 RESET.3 RESET.4 TYPE-C.13 TYPE-C.14 TYPE-C.15 TYPE-C.16 TYPE-C.A1B12 TYPE-C.B1A12 U4.GND U5.2 U6.1 U8.43 U8.86 U8.87 U8.88 U8.89 U8.90 U8.91 U8.92 U8.93 U8.95 U8.96 U8.GND U9.82 U9.83
VBUS: MICRO-USB.1 TYPE-C.A4B9 TYPE-C.B4A9 U7.1
VCC: 10UF#6.2 AMS1117.3 POWER.3 POWER.5
32W_CLK: ESP32-WROVER-B/IB/E/IE烧录架1.32W_CLK H4.14
32W_CMD: ESP32-WROVER-B/IB/E/IE烧录架1.32W_CMD H3.18
32W_IO2: ESP32-WROVER-B/IB/E/IE烧录架1.32W_IO2 H4.10
32W_IO4: ESP32-WROVER-B/IB/E/IE烧录架1.32W_IO4 H4.9
32W_IO5: ESP32-WROVER-B/IB/E/IE烧录架1.32W_IO5 H4.8
32W_IO12: ESP32-WROVER-B/IB/E/IE烧录架1.32W_IO12 H3.14 NOREF#37.6
32W_IO13: ESP32-WROVER-B/IB/E/IE烧录架1.32W_IO13 H3.15
32W_IO14: ESP32-WROVER-B/IB/E/IE烧录架1.32W_IO14 H3.13 NOREF#18.5
32W_IO15: ESP32-WROVER-B/IB/E/IE烧录架1.32W_IO15 H4.13
32W_IO18: ESP32-WROVER-B/IB/E/IE烧录架1.32W_IO18 H4.7
32W_IO19: ESP32-WROVER-B/IB/E/IE烧录架1.32W_IO19 H4.6
32W_IO21: ESP32-WROVER-B/IB/E/IE烧录架1.32W_IO21 H4.5
32W_IO22: ESP32-WROVER-B/IB/E/IE烧录架1.32W_IO22 H4.2
32W_IO23: ESP32-WROVER-B/IB/E/IE烧录架1.32W_IO23 H4.1
32W_IO25: ESP32-WROVER-B/IB/E/IE烧录架1.32W_IO25 H3.10 IO25#2.1
32W_IO26: ESP32-WROVER-B/IB/E/IE烧录架1.32W_IO26 H3.11
32W_IO27: ESP32-WROVER-B/IB/E/IE烧录架1.32W_IO27 H3.12
32W_IO32: ESP32-WROVER-B/IB/E/IE烧录架1.32W_IO32 H3.8
32W_IO33: ESP32-WROVER-B/IB/E/IE烧录架1.32W_IO33 H3.9
32W_IO34: ESP32-WROVER-B/IB/E/IE烧录架1.32W_IO34 H3.6
32W_IO35: ESP32-WROVER-B/IB/E/IE烧录架1.32W_IO35 H3.7
32W_SD0: ESP32-WROVER-B/IB/E/IE烧录架1.32W_SD0 H4.15
32W_SD1: ESP32-WROVER-B/IB/E/IE烧录架1.32W_SD1 H4.12
32W_SD2: ESP32-WROVER-B/IB/E/IE烧录架1.32W_SD2 H3.16
32W_SD3: ESP32-WROVER-B/IB/E/IE烧录架1.32W_SD3 H3.17
32W_VN: ESP32-WROVER-B/IB/E/IE烧录架1.32W_VN H3.5
32W_VP: ESP32-WROVER-B/IB/E/IE烧录架1.32W_VP H3.4
ADC: H8.2 U4.ADC
CC1: 5.1K.1 TYPE-C.A5
CC2: 5.1K#2.1 TYPE-C.B5
D+: CH340C.5 MICRO-USB.3 TYPE-C.A6 TYPE-C.B6
D-: CH340C.6 MICRO-USB.2 TYPE-C.A7 TYPE-C.B7
EN: 1UF.2 10K#4.1 ESP32-WROVER-B/IB/E/IE烧录架1.EN H2.1 H3.3 H8.3 RESET.1 RESET.2 S8050.3 U4.EN U5.3 U8.EN U9.EN
ESP32_CLK: H6.17 U9.ESP32_CLK
ESP32_CMD: H6.18 U9.ESP32_CMD
ESP32_GND: H6.14 U6.2 U9.ESP32_GND
ESP32_IO2: 10K.1 H7.15 U9.ESP32_IO02
ESP32_IO4: H7.12 U9.ESP32_IO4
ESP32_IO5: H7.9 U9.ESP32_IO05
ESP32_IO12: H6.12 U9.ESP32_IO12
ESP32_IO13: H6.13 U9.ESP32_IO13
ESP32_IO14: H6.9 U9.ESP32_IO14
ESP32_IO15: H7.16 U9.ESP32_IO15
ESP32_IO16: H7.11 U9.ESP32_IO16
ESP32_IO17: H7.10 U9.ESP32_IO17
ESP32_IO18: H7.8 U9.ESP32_IO18
ESP32_IO19: H7.7 U9.ESP32_IO19
ESP32_IO21: H7.5 U9.ESP32_IO21
ESP32_IO22: H7.2 U9.ESP32_IO22
ESP32_IO23: H7.1 U9.ESP32_IO23
ESP32_IO25: H6.8 IO25.1 U9.ESP32_IO25
ESP32_IO26: H6.7 U9.ESP32_IO26
ESP32_IO27: H6.10 U9.ESP32_IO27
ESP32_IO32: H6.6 U9.ESP32_IO32
ESP32_IO33: H6.5 U9.ESP32_IO33
ESP32_IO34: H6.4 U9.ESP32_IO34
ESP32_IO35: H6.3 U9.ESP32_IO35
ESP32_NC: H7.6 U9.ESP32_NC
ESP32_SD0: H7.18 U9.ESP32_SD0
ESP32_SD1: H7.17 U9.ESP32_SD1
ESP32_SD2: H6.16 U9.ESP32_SD2
ESP32_SD3: H6.15 U9.ESP32_SD3
ESP32_VN: H6.1 U9.ESP32_VN
ESP32_VP: H6.2 U9.ESP32_VP
IO0: 10K#2.1 BOOT.1 BOOT.2 ESP32-WROVER-B/IB/E/IE烧录架1.IO0 H1.4 H4.11 H7.13 H9.5 Q1.3 U4.IO0 U5.6 U8.IO0 U9.IO0
IO2: 10K#3.1 H9.6 U4.IO2 U5.4
IO4: H9.4 U4.IO4
IO5: H9.3 U4.IO5
IO12: H8.6 U4.IO12
IO13: H8.7 IO13.1 U4.IO13
IO14: H8.5 U4.IO14
IO15: 10K#5.1 H9.7 U4.IO15
IO16: H8.4 U4.IO16
Q1_1: 10K#6.2 Q1.1
Q1_2: CH340C.13 Q1.2 R9.1
Q2_1: R9.2 S8050.1
Q2_2: 10K#6.1 CH340C.14 S8050.2
R5_2: 1K#7.2 RXD.2
R6_2: 1K#6.2 TXD.2
R7_2: 1K#5.2 PWR.1
R14_2: 1K#2.2 IO25.2
R15_2: 1K.2 IO13.2
R16_2: 1K#3.2 IO25#2.2
R17_2: 1K#4.2 IO5.2
RST: H8.1 U4.RST U5.5
RXD: ESP32-WROVER-B/IB/E/IE烧录架1.RXD H2.4 H4.4 H5.5 H7.4 H9.2 R13.1 U4.RXD U5.8 U8.RXD U9.RXD
RXD0: 470.2 CH340C.3 RXD.1
S2_IO1: H1.3 U8.S2_IO1
S2_IO2: H1.6 U8.S2_IO2
S2_IO3: H1.5 U8.S2_IO3
S2_IO4: H1.8 U8.S2_IO4
S2_IO5: H1.7 IO5.1 U8.S2_IO5
S2_IO6: H1.10 U8.S2_IO6
S2_IO7: H1.9 U8.S2_IO7
S2_IO8: H1.11 U8.S2_IO8
S2_IO9: H1.12 U8.S2_IO9
S2_IO10: H1.13 U8.S2_IO10
S2_IO11: H1.14 U8.S2_IO11
S2_IO12: H1.15 U8.15
S2_IO13: H1.16 U8.S2_IO13
S2_IO14: H1.18 U8.S2_IO14
S2_IO15: H1.17 U8.S2_IO15
S2_IO16: H1.20 U8.S2_IO16
S2_IO17: H1.19 U8.S2_IO17
S2_IO18: H2.20 U8.S2_IO18
S2_IO19: H2.19 U8.S2_IO19
S2_IO20: H2.18 U8.S2_IO20
S2_IO21: H2.17 U8.S2_IO21
S2_IO26: H2.16 U8.S2_IO26
S2_IO33: H2.15 U8.S2_IO33
S2_IO34: H2.14 U8.S2_IO34
S2_IO35: H2.13 U8.S2_IO35
S2_IO36: H2.12 U8.S2_IO36
S2_IO37: H2.11 U8.S2_IO37
S2_IO38: H2.10 U8.S2_IO38
S2_IO39: H2.9 U8.S2_IO39
S2_IO40: H2.8 U8.94
S2_IO41: H2.7 U8.S2_IO40
S2_IO42: H2.6 U8.S2_IO41
S2_IO45: H2.3 U8.S2_IO45
S2_IO46: H2.2 U8.S2_IO46
TXD: 470.1 ESP32-WROVER-B/IB/E/IE烧录架1.TXD H2.5 H4.3 H5.4 H7.3 H9.1 U4.TXD U5.1 U8.TXD U9.TXD
TXD0: CH340C.2 R13.2 TXD.1

Pads without a net: CH340C 7 8 9 10 11 12 15; ESP32-WROVER-B/IB/E/IE烧录架1 27 28 32 39 40 41 42 43 44 45 46 47 48 49 50 51 52 53 54 55 56 57 58 59 60 61 62 63 64 65 66 67 68 69 70 71 72 73 74 75 76; H4 16 17 18; H6 11; H7 14; MICRO-USB 4; NOREF 1; NOREF#2 1; NOREF#3 1; NOREF#4 1; NOREF#5 1; NOREF#6 1; NOREF#7 1; NOREF#8 1; NOREF#9 1; NOREF#10 1; NOREF#11 1; NOREF#12 1; NOREF#13 1; NOREF#14 1; NOREF#15 1; NOREF#16 1; NOREF#17 1; NOREF#19 1; NOREF#20 1; NOREF#21 1; NOREF#22 1; NOREF#23 1; NOREF#24 1; NOREF#25 1; NOREF#26 1; NOREF#27 1; NOREF#28 1; NOREF#29 1; NOREF#30 1; NOREF#31 1; NOREF#32 1; NOREF#33 1; NOREF#34 1; NOREF#35 1; NOREF#36 1; NOREF#38 1; POWER 1 6; TYPE-C A8 B8; U4 23 24 25 26 27 28 29 30 31 32 33 34 35 36 37 38; U6 3; U8 44 45 46 47 48 49 50 51 52 53 54 55 56 58 59 60 61 62 63 64 65 66 67 68 69 70 71 72 73 74 75 76 77 78 79 80 81 82 83 84 85 S2_IO12; U9 40 41 42 43 44 45 46 47 48 49 50 51 52 53 54 55 56 57 58 59 60 61 62 63 64 65 66 67 68 69 70 71 72 73 74 75 76 77 78 79 80 81 GND

## Via types
v1: diameter 0.61, hole 0.305, Top Layer to Bottom Layer, 72 vias

## Routing (per net, layer and track width the routed paths; a pad name or vN(x,y) marks a point on that pad's centre or on a via; arc(x,y) is an arc through that point)
3V3: length 365.5
  Top Layer w0.254: v1(52.08,50.09) 49.92,52.25 29.6,52.25 28.74,53.11 H5.3 28.74,58.05 1K#6.1 1K#7.1 ; v1(52.08,50.09) 52.08,48.2 U5.7 47.12,43.23 43.57,43.23 v1(42.56,42.22) ; v1(52.08,50.09) 52.08,50.12 63.37,61.41 ; AMS1117.4 AMS1117.2 10.93,66.85 11.82,67.74 16.27,67.74 v1(17.28,68.76) CH340C.4 17.28,71.17 13.47,74.98 CH340C.16 ; 6.37,9.95 8.65,7.67 H3.2 ; 6.37,9.95 1K#3.1 ; 6.37,9.95 6.39,9.95 ESP32-WROVER-B/IB/E/IE烧录架1.3V3 9.82,13.39 v1(31.76,13.39) ; 30.17,70.19 100NF#4.2 30.17,66.24 100NF#3.1 ; 30.17,70.19 31.61,70.19 10UF#4.2 ; 30.17,70.19 100NF.1 ; 30.17,70.19 30.17,72.17 ; 10K#4.2 10K#2.2 23.01,89.6 24.9,91.49 38.88,91.49 1K#2.1 ; 1K.1 85.47,63.3 v1(83.7,63.3) ; 100NF#5.2 31.62,76.13 10UF#2.1 ; 100NF#5.2 100NF#6.2 30.17,72.17 ; 100NF#5.2 100NF#7.2 10UF#5.2 32.59,84.44 1K#2.1 ; 30.17,72.17 100NF#2.1 ; 30.17,72.17 32.55,72.17 10UF#3.1 ; v1(23.54,65.58) 25.67,65.58 26.3,64.95 29.73,64.95 30.16,65.38 100NF#3.1 ; U9.3V3 44.62,89.84 40.14,89.84 39.26,90.72 1K#2.1 ; H1.1 80.4,3.74 1K#4.1 80.39,4.25 79.41,5.23 U8.3V3 ; U4.3V3 63.37,61.41 ; 63.37,61.41 H8.8 ; v1(69.86,34.22) v1(75.07,34.22) ; 10UF.1 32.58,66.22 100NF#3.1 ; v1(52.21,32.95) 41.03,32.95 v1(38.37,30.28)
  Top Layer w0.3: 1K#5.1 11.19,81.83 11.19,78.24 CH340C.16
  Bottom Layer w0.254: H1.1 85.86,9.2 85.86,31.55 83.2,34.22 v1(75.07,34.22) ; v1(83.7,63.3) 64.91,63.3 63.37,61.76 H8.8 ; v1(31.76,13.39) 35.83,17.45 35.83,27.74 v1(38.37,30.28) 42.56,34.47 v1(42.56,42.22) ; v1(23.54,65.58) 20.37,68.76 v1(17.28,68.76) ; v1(69.86,34.22) 60.09,34.22 v1(58.69,35.61) 56.03,32.95 v1(52.21,32.95)
+5V: length 48.4
  Top Layer w0.5: U7.2 3.31,74.18 POWER.4 3.35,76.04 5.85,78.54 POWER.2
  Bottom Layer w0.5: H5.2 31.28,60.98 13.73,78.54 POWER.2
GND:
  vias: v1(4.58,78.54) v1(6.63,54.71) v1(6.63,48.27) v1(19.57,79.94) v1(21.6,84.34) v1(33.29,41.96) v1(36.97,48.57) v1(37.86,36.76) v1(38.37,13.39) v1(51.45,39.42) v1(52.21,35.99) v1(59.96,55.93) v1(60.21,60.25) v1(70.24,66.47) v1(74.18,68.76) v1(77.86,15.04) v1(77.86,13.51) v1(77.86,12.12) v1(77.86,10.55) v1(77.86,7.55)
VBUS: length 33.2
  Top Layer w0.5: MICRO-USB.1 5.25,64.98 v1(5.98,65.71) 5.98,72.57 U7.1
  Bottom Layer w0.5: v1(5.98,65.71) 5.85,65.58 5.85,58.98 3.31,56.44 3.31,52.35 v1(6.63,49.04) v1(6.63,53.94)
VCC: length 26.5
  Top Layer w0.5: POWER.5 3.31,78.54 5.81,81.04 POWER.3 ; POWER.3 7.46,81.45 10UF#6.2 ; POWER.3 9.03,79.47 9.03,74.09 8.64,73.7 AMS1117.3
32W_CLK: length 11
  Top Layer w0.254: ESP32-WROVER-B/IB/E/IE烧录架1.32W_CLK 27.7,38.36 27.7,41.2 27.06,41.84 25.54,41.84 24.27,43.11 H4.14
32W_CMD: length 5.5
  Top Layer w0.254: H3.18 28.97,10.96 ESP32-WROVER-B/IB/E/IE烧录架1.32W_CMD
32W_IO2: length 10.9
  Top Layer w0.254: H4.10 20.08,41.84 21.86,41.84 22.62,41.07 22.62,38.37 ESP32-WROVER-B/IB/E/IE烧录架1.32W_IO2
32W_IO4: length 6.3
  Top Layer w0.254: ESP32-WROVER-B/IB/E/IE烧录架1.32W_IO4 22.62,36.12 18.81,39.93 H4.9
32W_IO5: length 8.3
  Top Layer w0.254: H4.8 17.63,41.74 17.63,37.01 ESP32-WROVER-B/IB/E/IE烧录架1.32W_IO5
32W_IO12: length 5
  Top Layer w0.254: NOREF#37.6 23.89,12.1
32W_IO13: length 8.6
  Top Layer w0.254: ESP32-WROVER-B/IB/E/IE烧录架1.32W_IO13 25.16,10.96 25.16,6.53 26.43,5.26 H3.15
32W_IO14: length 8
  Top Layer w0.254: 22.62,12.1 22.62,6.53 23.89,5.26 NOREF#18.5
32W_IO15: length 5.8
  Top Layer w0.254: H4.13 23.89,38.37 ESP32-WROVER-B/IB/E/IE烧录架1.32W_IO15
32W_IO18: length 5.3
  Top Layer w0.254: ESP32-WROVER-B/IB/E/IE烧录架1.32W_IO18 16.27,37.1 H4.7
32W_IO19: length 8.3
  Top Layer w0.254: H4.6 15.09,41.74 15.09,37.01 ESP32-WROVER-B/IB/E/IE烧录架1.32W_IO19
32W_IO21: length 4.7
  Top Layer w0.254: H4.5 ESP32-WROVER-B/IB/E/IE烧录架1.32W_IO21
32W_IO22: length 7.8
  Top Layer w0.254: H4.2 9.92,41.84 ESP32-WROVER-B/IB/E/IE烧录架1.32W_IO22
32W_IO23: length 4.7
  Top Layer w0.254: H4.1 ESP32-WROVER-B/IB/E/IE烧录架1.32W_IO23
32W_IO25: length 21.5
  Top Layer w0.254: IO25#2.1 3.44,10.46 4.2,11.23 v1(4.46,11.23) ; H3.10 ESP32-WROVER-B/IB/E/IE烧录架1.32W_IO25
  Bottom Layer w0.254: v1(4.46,11.23) 17.81,11.23 ESP32-WROVER-B/IB/E/IE烧录架1.32W_IO25
32W_IO26: length 8
  Top Layer w0.254: H3.11 21.35,5.39 20.08,6.66 ESP32-WROVER-B/IB/E/IE烧录架1.32W_IO26
32W_IO27: length 5
  Top Layer w0.254: H3.12 ESP32-WROVER-B/IB/E/IE烧录架1.32W_IO27
32W_IO32: length 5
  Top Layer w0.254: H3.8 ESP32-WROVER-B/IB/E/IE烧录架1.32W_IO32
32W_IO33: length 8
  Top Layer w0.254: H3.9 18.81,5.39 17.54,6.66 ESP32-WROVER-B/IB/E/IE烧录架1.32W_IO33
32W_IO34: length 5
  Top Layer w0.254: H3.6 ESP32-WROVER-B/IB/E/IE烧录架1.32W_IO34
32W_IO35: length 8
  Top Layer w0.254: H3.7 16.27,5.39 15,6.66 ESP32-WROVER-B/IB/E/IE烧录架1.32W_IO35
32W_SD0: length 5.8
  Top Layer w0.254: H4.15 26.43,38.37 ESP32-WROVER-B/IB/E/IE烧录架1.32W_SD0
32W_SD1: length 11
  Top Layer w0.254: ESP32-WROVER-B/IB/E/IE烧录架1.32W_SD1 25.16,38.37 25.16,41.2 24.52,41.84 22.62,41.84 H4.12
32W_SD2: length 5.5
  Top Layer w0.254: H3.16 26.43,10.96 ESP32-WROVER-B/IB/E/IE烧录架1.32W_SD2
32W_SD3: length 8.6
  Top Layer w0.254: H3.17 28.97,5.26 27.7,6.53 27.7,10.96 ESP32-WROVER-B/IB/E/IE烧录架1.32W_SD3
32W_VN: length 8
  Top Layer w0.254: ESP32-WROVER-B/IB/E/IE烧录架1.32W_VN 12.46,6.66 13.73,5.39 H3.5
32W_VP: length 5
  Top Layer w0.254: H3.4 ESP32-WROVER-B/IB/E/IE烧录架1.32W_VP
ADC: length 2.5
  Top Layer w0.254: U4.ADC 78.61,60.77 H8.2
CC1: length 4.7
  Top Layer w0.254: 5.1K.1 9,53.75 7.99,52.74 TYPE-C.A5
CC2: length 5
  Top Layer w0.254: 5.1K#2.1 9.69,48.42 8.37,49.74 TYPE-C.B5
D+: length 42.1
  Top Layer w0.254: v1(7.12,63.3) 6.74,63.68 MICRO-USB.3 ; TYPE-C.A6 10.04,51.74 v1(10.04,51.74) 10.05,51.74 11.04,51.74 14.87,55.56 v1(14.87,61.65) 14.87,64.82 18.55,68.51 18.55,70.16 ; TYPE-C.B6 8.51,50.74 v1(9.28,49.96)
  Bottom Layer w0.254: v1(10.04,51.74) 10.04,50.73 v1(9.28,49.96) ; v1(14.87,61.65) 13.6,62.92 7.5,62.92 v1(7.12,63.3)
D-: length 43.6
  Top Layer w0.254: v1(9.28,52.63) 8.77,52.63 8.38,52.24 TYPE-C.B7 ; v1(7.12,64.95) 6.5,64.33 MICRO-USB.2 ; TYPE-C.A7 9.03,51.24 v1(9.28,50.98) 9.54,50.73 10.81,50.73 15.51,55.42 v1(15.51,64.31) 19.82,68.63 CH340C.6
  Bottom Layer w0.254: v1(9.28,50.98) v1(9.28,52.63) ; v1(7.12,64.95) 7.89,64.19 15.38,64.19 v1(15.51,64.31)
EN: length 218.5
  Top Layer w0.254: v1(46.37,86.79) 48.27,84.89 U9.EN ; ESP32-WROVER-B/IB/E/IE烧录架1.EN 9.92,6.66 11.19,5.39 H3.3 13.57,2.34 42.92,2.34 H2.1 50.9,7.68 U8.EN ; v1(52.21,38.66) v1(56.27,42.72) ; v1(36.46,71.55) 36.46,68.38 38.73,66.11 47.68,66.11 56.71,57.08 v1(57.29,57.08) ; RESET.1 17.19,90.07 10K#4.1 18.56,86.37 v1(19.32,85.62) 19.32,85.02 18.81,84.51 16.9,84.51 16.37,83.98 RESET.2 16.37,82.01 1UF.2 ; H8.3 76.07,60.26 U4.EN
  Bottom Layer w0.254: v1(50.56,37.01) 50.56,9.98 H2.1 ; v1(50.56,37.01) v1(52.21,38.66) ; v1(50.56,37.01) U5.3 ; v1(46.37,86.79) 37.48,86.79 36.46,85.78 ; 36.46,85.78 36.3,85.62 v1(19.32,85.62) ; 36.46,85.78 v1(36.46,71.55) ; U4.EN 75.27,59.56 74.31,58.6 58.81,58.6 v1(57.29,57.08) 57.29,43.74 v1(56.27,42.72)
ESP32_CLK: length 22.9
  Top Layer w0.254: H6.17 41.99,66.56 47.87,66.56 50.86,63.58 57.85,63.58 U9.ESP32_CLK
ESP32_CMD: length 18.7
  Top Layer w0.254: H6.18 47.34,67.74 51.05,64.03 57.04,64.03 U9.ESP32_CMD
ESP32_GND: length 27.7
  Top Layer w0.254: H6.14 44.84,72.82 51.8,65.86 53.76,65.86 54.37,66.47 U9.ESP32_GND
  Bottom Layer w0.254: U6.2 49.92,65.84 53.76,65.84 U9.ESP32_GND
ESP32_IO2: length 14.1
  Top Layer w0.254: H7.15 74.05,70.16 10K.1 71.76,66.59 70.97,65.8 66.5,65.8 U9.ESP32_IO02
ESP32_IO4: length 9
  Top Layer w0.254: 71.92,72.19 74.18,72.19 75.96,73.97 78.4,73.97 H7.12
ESP32_IO5: length 5.9
  Top Layer w0.254: U9.ESP32_IO05 74.18,76 75.96,77.78 H7.9
ESP32_IO12: length 6.8
  Top Layer w0.254: H6.12 43.86,75.36 U9.ESP32_IO12
ESP32_IO13: length 18.4
  Top Layer w0.254: U9.ESP32_IO13 55.67,66.38 54.7,65.4 51.62,65.4 45.56,71.46 42.17,71.46 H6.13
ESP32_IO14: length 9.9
  Top Layer w0.254: H6.9 42.08,76.63 43.86,76.63 U9.ESP32_IO14
ESP32_IO15: length 17.6
  Top Layer w0.254: U9.ESP32_IO15 65.69,65.34 72.42,65.34 75.96,68.89 78.4,68.89 H7.16
ESP32_IO16: length 5.9
  Top Layer w0.254: H7.11 75.96,75.24 74.18,73.46 U9.ESP32_IO16
ESP32_IO17: length 9
  Top Layer w0.254: H7.10 78.4,76.51 75.96,76.51 74.18,74.73 U9.ESP32_IO17
ESP32_IO18: length 9
  Top Layer w0.254: U9.ESP32_IO18 74.18,77.27 75.96,79.05 78.4,79.05 H7.8
ESP32_IO19: length 5.9
  Top Layer w0.254: U9.ESP32_IO19 74.18,78.54 75.96,80.32 H7.7
ESP32_IO21: length 5.9
  Top Layer w0.254: H7.5 75.96,82.86 74.18,81.08 U9.ESP32_IO21
ESP32_IO22: length 9
  Top Layer w0.254: H7.2 78.4,86.67 75.96,86.67 74.18,84.89 U9.ESP32_IO22
ESP32_IO23: length 5.9
  Top Layer w0.254: H7.1 75.96,87.94 74.18,86.16 U9.ESP32_IO23
ESP32_IO25: length 19.1
  Top Layer w0.254: H6.8 43.86,80.44 U9.ESP32_IO25
  Bottom Layer w0.254: v1(47.29,91.12) 47.29,86.32 44.84,83.87 44.84,81.94 H6.8
ESP32_IO26: length 9.9
  Top Layer w0.254: H6.7 42.08,79.17 43.86,79.17 U9.ESP32_IO26
ESP32_IO27: length 6.9
  Top Layer w0.254: 48.3,73.3 48.3,73.45 44.01,77.74 43.35,77.74
ESP32_IO32: length 6.8
  Top Layer w0.254: U9.ESP32_IO32 43.86,82.98 H6.6
ESP32_IO33: length 9.9
  Top Layer w0.254: H6.5 42.08,81.71 43.86,81.71 U9.ESP32_IO33
ESP32_IO34: length 6.8
  Top Layer w0.254: H6.4 43.86,85.52 U9.ESP32_IO34
ESP32_IO35: length 9.9
  Top Layer w0.254: H6.3 42.08,84.25 43.86,84.25 U9.ESP32_IO35
ESP32_NC: length 9
  Top Layer w0.254: H7.6 78.4,81.59 75.96,81.59 74.18,79.81 U9.ESP32_NC
ESP32_SD0: length 19.8
  Top Layer w0.254: H7.18 76.48,64.43 64.06,64.43 U9.ESP32_SD0
ESP32_SD1: length 15.6
  Top Layer w0.254: H7.17 74.4,64.89 64.84,64.89 63.29,66.44 63.29,66.47
ESP32_SD2: length 16.4
  Top Layer w0.254: U9.ESP32_SD2 55.41,64.95 51.43,64.95 46.09,70.28 H6.16
ESP32_SD3: length 20.6
  Top Layer w0.254: H6.15 42.08,69.01 46.71,69.01 51.24,64.49 56.22,64.49 U9.ESP32_SD3
ESP32_VN: length 9.9
  Top Layer w0.254: 40.81,88.06 42.08,86.79 43.86,86.79 U9.ESP32_VN
ESP32_VP: length 6.8
  Top Layer w0.254: 43.35,88.06 43.86,88.06 U9.ESP32_VP
IO0: length 210.2
  Top Layer w0.254: ESP32-WROVER-B/IB/E/IE烧录架1.IO0 21.35,38.37 H4.11 ; U9.IO0 74.18,70.92 75.96,72.7 H7.13 ; 81.93,10.34 78.32,6.73 U8.IO0 ; v1(38.75,54.79) 39.76,55.81 v1(54.62,55.81) ; v1(28.21,80.7) 26.58,82.32 BOOT.1 24.23,85.62 Q1.3 24.51,86.37 10K#2.1 25.88,90.07 BOOT.2 ; U4.IO0 71.28,36.66 H9.5 68.47,33.86 55.61,33.86 48.91,40.57 47,40.57 U5.6 44.7,40.82 v1(38.75,40.82)
  Bottom Layer w0.254: U8.IO0 75.83,7.86 75.83,31.53 H9.5 ; U9.IO0 71.92,66.12 69.56,63.76 62.57,63.76 v1(54.62,55.81) ; ESP32-WROVER-B/IB/E/IE烧录架1.IO0 24.52,35.21 33.13,35.21 v1(38.75,40.82) v1(38.75,54.79) 35.44,58.09 35.44,78.54 33.29,80.7 v1(28.21,80.7)
IO2: length 29.2
  Top Layer w0.254: v1(60.2,35.61) 61.29,34.52 66.61,34.52 68.45,36.36 H9.6 69.25,37.17 U4.IO2
  Bottom Layer w0.254: v1(60.2,35.61) 59.44,36.37 55.64,36.37 51.45,40.57 46.99,40.57 U5.4
IO4: length 2.5
  Top Layer w0.254: U4.IO4 73.53,38.52 H9.4
IO5: length 2.7
  Top Layer w0.254: H9.3 76.07,38.01 U4.IO5
IO12: length 2.3
  Top Layer w0.254: H8.6 69.27,60.69 U4.IO12
IO13: length 26.1
  Top Layer w0.254: IO13.1 86.28,64.44 84.59,64.44 84.12,63.97 67.61,63.97 65.91,62.27 H8.7 67.24,60.19 U4.IO13
IO14: length 2.1
  Top Layer w0.254: H8.5 71.31,61.2 U4.IO14
IO15: length 10.1
  Top Layer w0.254: 10K#5.1 62.49,34.98 64.51,34.98 H9.7 67.21,37.68 U4.IO15
IO16: length 2
  Top Layer w0.254: H8.4 73.53,59.75 U4.IO16
Q1_1: length 3.6
  Top Layer w0.254: 22.81,83.15 22.81,82.96 21.19,81.33 10K#6.2
Q1_2: length 12.3
  Top Layer w0.254: Q1.2 24.71,82.54 24.4,82.22 23.39,82.22 23.13,81.97 R9.1 23.13,80.83 21.09,78.79 18.55,78.79 17.28,77.52 CH340C.13
Q2_1: length 7
  Bottom Layer w0.254: v1(24.64,81.33) 23.62,82.35 19.16,82.35 v1(18.37,83.15)
Q2_2: length 9.7
  Top Layer w0.254: CH340C.14 16.01,77.52 18.56,80.07 10K#6.1 18.56,81.97 18.82,82.22 20.08,82.22 20.27,82.41 S8050.2
R5_2: length 1.9
  Top Layer w0.254: 1K#7.2 21.99,65.59 RXD.2
R6_2: length 1.9
  Top Layer w0.254: 1K#6.2 21.99,63.3 TXD.2
R7_2: length 5.8
  Top Layer w0.3: PWR.1 9.7,87.09 7.77,85.15 1K#5.2
R14_2: length 4.9
  Top Layer w0.254: IO25.2 45.69,91.11 1K#2.2
R15_2: length 1.9
  Top Layer w0.254: IO13.2 85.53,61.74 1K.2
R16_2: length 2.3
  Top Layer w0.254: 1K#3.2 3.49,8.44 IO25#2.2
R17_2: length 1.9
  Top Layer w0.254: 1K#4.2 78.84,3.69 IO5.2
RST: length 41.2
  Top Layer w0.254: H8.1 81.15,61.27 U4.RST 78.48,58.6 65.02,58.6 U5.5
RXD: length 193.5
  Top Layer w0.254: 53.33,9.74 51.59,11.48 46.98,11.48 H2.4 ; H7.4 78.4,84.13 75.96,84.13 74.18,82.35 U9.RXD 70.95,81.38 70.95,70.23 68.97,68.25 v1(68.97,67.74) ; v1(60.08,41.2) 61.73,39.55 76.56,39.55 U4.RXD 78.61,37.5 H9.2 ; ESP32-WROVER-B/IB/E/IE烧录架1.RXD 12.46,41.84 H4.4 19.94,51.86 R13.1 22.49,53.39 H5.5 23.66,54.25 30.24,47.68 42.43,47.68 v1(43.32,46.79) U5.8
  Bottom Layer w0.254: v1(60.08,41.2) 53.1,41.2 51.07,43.23 46.87,43.23 U5.8 43.95,42.61 43.95,11.98 H2.4 ; v1(68.97,67.74) 68.97,66.82 66.37,64.21 60.74,64.21 v1(43.32,46.79)
RXD0: length 17.3
  Top Layer w0.254: 470.2 17.54,55.68 v1(17.16,56.06) ; RXD.1 18.55,65.58 v1(18.55,65.58) ; v1(16.01,68.76) CH340C.3
  Bottom Layer w0.254: v1(17.16,56.06) 17.16,64.19 v1(18.55,65.58) 16.01,68.12 v1(16.01,68.76)
S2_IO1: length 8.4
  Bottom Layer w0.254: 84.47,10.34 83.11,8.98 77.7,8.98 U8.S2_IO1
S2_IO2: length 6.3
  Top Layer w0.254: U8.S2_IO2 78.78,9.73 H1.6
S2_IO3: length 8.2
  Bottom Layer w0.254: H1.5 83.11,11.52 77.25,11.52 U8.S2_IO3
S2_IO4: length 6.1
  Top Layer w0.254: H1.8 79.23,12.73 U8.S2_IO4
S2_IO5: length 24.4
  Top Layer w0.254: v1(75.83,3.74) 75.83,13.1 U8.S2_IO5
  Bottom Layer w0.254: v1(75.83,3.74) 77.73,1.83 v1(80.44,1.83) ; H1.7 83.27,14.23 U8.S2_IO5
S2_IO6: length 5.9
  Top Layer w0.254: 81.93,17.96 79.69,15.72 U8.S2_IO6
S2_IO7: length 8.2
  Bottom Layer w0.254: U8.S2_IO7 77.4,16.78 83.29,16.78 84.47,17.96
S2_IO8: length 8.2
  Top Layer w0.254: U8.S2_IO8 77.37,19.14 83.11,19.14 H1.11
S2_IO9: length 5.1
  Top Layer w0.254: H1.12 81.65,20.22 U8.S2_IO9
S2_IO10: length 8.1
  Top Layer w0.254: H1.13 83.15,21.72 U8.S2_IO10
S2_IO11: length 5
  Top Layer w0.254: U8.S2_IO11 77.13,23.04 H1.14
S2_IO12: length 8.1
  Top Layer w0.254: U8.15 77.27,24.4 83.29,24.4 84.47,25.58
S2_IO13: length 5.2
  Top Layer w0.254: U8.S2_IO13 77.59,25.58 81.93,25.58
S2_IO14: length 11
  Top Layer w0.254: H1.18 77.48,28.12 75.2,30.41 71.88,30.41
S2_IO15: length 15.7
  Top Layer w0.254: H1.17 83.29,29.3 77.7,29.3 75.83,31.17 71.13,31.17 70.38,30.42 70.38,30.41
S2_IO16: length 14.2
  Top Layer w0.254: H1.20 80.66,31.93 70.41,31.93 68.89,30.41
S2_IO17: length 18.9
  Top Layer w0.254: H1.19 82.43,32.69 69.67,32.69 67.39,30.41
S2_IO18: length 22.3
  Top Layer w0.254: H2.20 47.11,31.93 53.35,31.93 54.37,32.95 63.51,32.95 65.89,30.56 65.89,30.41
S2_IO19: length 17.8
  Top Layer w0.254: H2.19 52.97,30.54 54.88,32.44 62.37,32.44 64.4,30.41
S2_IO20: length 19.4
  Top Layer w0.254: 62.9,30.41 61.38,31.93 55.51,31.93 52.76,29.17 46.89,29.17 H2.18
S2_IO21: length 15
  Top Layer w0.254: 61.41,30.41 60.39,31.42 56.13,31.42 52.71,28 H2.17
S2_IO26: length 16.2
  Top Layer w0.254: 59.91,30.41 58.39,28.88 54.75,28.88 52.5,26.63 46.89,26.63 H2.16
S2_IO33: length 5.4
  Top Layer w0.254: H2.15 52.55,25.46 U8.S2_IO33
S2_IO34: length 8.4
  Top Layer w0.254: 53.33,24.74 52.69,24.09 46.89,24.09 H2.14
S2_IO35: length 5.2
  Top Layer w0.254: U8.S2_IO35 53.01,22.92 H2.13
S2_IO36: length 8.2
  Top Layer w0.254: H2.12 47.08,21.74 53.33,21.74
S2_IO37: length 5.1
  Top Layer w0.254: H2.11 53.2,20.38 U8.S2_IO37
S2_IO38: length 8.2
  Top Layer w0.254: H2.10 46.89,19.01 53.06,19.01 53.33,18.74
S2_IO39: length 5.3
  Top Layer w0.254: H2.9 52.74,17.84 U8.S2_IO39
S2_IO40: length 8.4
  Top Layer w0.254: H2.8 46.89,16.47 52.6,16.47 53.33,15.74
S2_IO41: length 5.5
  Top Layer w0.254: H2.7 52.28,15.3 U8.S2_IO40
S2_IO42: length 8.6
  Top Layer w0.254: 53.33,12.74 52.14,13.93 46.89,13.93 H2.6
S2_IO45: length 5.9
  Top Layer w0.254: U8.S2_IO45 51.36,10.22 H2.3
S2_IO46: length 9
  Top Layer w0.254: 53.33,6.74 51.22,8.85 46.89,8.85 H2.2
TXD: length 216.3
  Top Layer w0.254: H2.5 51.82,12.75 U8.TXD ; U4.TXD 81.15,36.98 H9.1 81.15,35.98 78.57,33.4 55.42,33.4 53.85,34.98 50.05,34.98 U5.1 45.72,34.22 v1(36.46,34.22) ; v1(36.46,34.22) 36.46,42.22 v1(40.91,46.66) ; v1(36.46,34.22) 12.81,34.22 ESP32-WROVER-B/IB/E/IE烧录架1.TXD H4.3 ; v1(68.08,67.74) 68.08,68.12 70.5,70.54 70.5,82.19 U9.TXD 74.18,83.62 75.96,85.4 H7.3 ; 470.1 23.18,55.68 23.19,55.69 25.07,55.69 H5.4
  Bottom Layer w0.254: v1(68.08,67.74) 68.08,66.57 66.18,64.67 58.91,64.67 v1(40.91,46.66) ; U5.1 50.05,34.98 50.05,14.55 H2.5 ; H5.4 25.69,54.56 15,43.87 15,42.34 14.49,41.84 12.46,41.84 H4.3
TXD0: length 21.8
  Top Layer w0.254: v1(16.39,54.15) 17.16,53.39 R13.2 ; v1(16.27,62.16) 17.41,63.3 TXD.1 ; v1(14.74,68.76) CH340C.2
  Bottom Layer w0.254: v1(14.74,68.76) 14.74,68.12 16.27,66.6 v1(16.27,62.16) 16.27,54.28 v1(16.39,54.15)

## Copper pours and planes (outline as drawn; the poured copper is in the pictures)
GND on Top Layer: -24.25,102.8 101.87,102.8 101.87,-46.18 -24.25,-46.18
GND on Bottom Layer: -44.95,134.55 151.4,134.55 151.4,-11.5 -44.95,-11.5

Small or netless copper shapes (teardrops, artwork), in the pictures only: 393 on Top Layer, 87 on Bottom Layer

## Text on the board
Bottom Silkscreen Layer: IO5 | IO7 | IO16 | IO18 | IO19 | IO3 | IO9 | IO11 | IO13 | IO6 | IO8 | IO4 | IO12 | IO15 | IO17 | IO20 | IO46 | IO10 | IO48 | 烧录ESP32-S2-SOLO(U)时参考背面引脚位号 | IO42 | IO40 | IO38 | IO36 | IO34 | IO21 | IO1 | TXD | IO0 | 烧录ESP32-S3-WROOM-1/2/1U时此两位引脚位号改变，其余不变 | IO2 | RXD | IO35 | IO45 | IO37 | IO33 | IO41 | IO39 | IO14 | IO47
Document Layer: 不要打印顶部外壳
Top Silkscreen Layer: IO23 | TXD | IO21 | IO18 | IO4 | IO0 | IO15 | SD0 | NC | GND | VCC | RXD | EN | VP | IO19 | VN | IO34 | IO35 | IO5 | IO32 | IO33 | IO2 | IO25 | IO26 | SD1 | IO27 | IO14 | CLK | IO12 | IO13 | SD2 | SD3 | CMD | IO22 | IO0/RST | GND/TXD | RXD/VCC | IO2/EN | ESP-01 | 32 | IO16 | IO17 | IO45 | IO20 | IO36 | IO38 | IO40 | IO42 | IO46 | IO37 | IO39 | IO41 | IO11 | IO9 | IO6 | IO7 | IO3 | IO1 | IO8 | IO10 | ADC | RST | 外部烧录接口 | 3V3 | +5V | ESP32 | ESP32-S3 | ESP系列烧录平台
